# Altium schematic sheet FPGA_CONFIG.SchDoc
size B
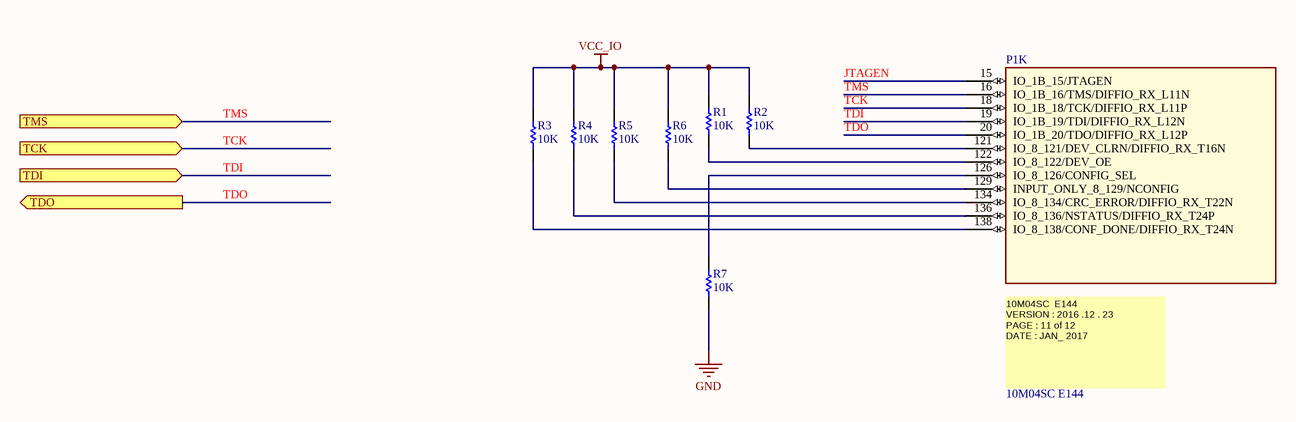
[diagram p0: FPGA_CONFIG.SchDoc]

## Parts
P1  10M04SC E144  (part K of 12)
R1  10K  [AXIAL-0.3]
R2  10K  [AXIAL-0.3]
R3  10K  [AXIAL-0.3]
R4  10K  [AXIAL-0.3]
R5  10K  [AXIAL-0.3]
R6  10K  [AXIAL-0.3]
R7  10K  [AXIAL-0.3]

## Ports
TCK (in), TDI (in), TDO (out), TMS (in)

## Nets
GND: R7.1
VCC_IO: R1.2 R2.2 R3.2 R4.2 R5.2 R6.2
JTAGEN: P1.15(IO_1B_15/JTAGEN)
TCK: P1.18(IO_1B_18/TCK/DIFFIO_RX_L11P) ; port TCK
TDI: P1.19(IO_1B_19/TDI/DIFFIO_RX_L12N) ; port TDI
TDO: P1.20(IO_1B_20/TDO/DIFFIO_RX_L12P) ; port TDO
TMS: P1.16(IO_1B_16/TMS/DIFFIO_RX_L11N) ; port TMS
NetP1_121: P1.121(IO_8_121/DEV_CLRN/DIFFIO_RX_T16N) R2.1
NetP1_122: P1.122(IO_8_122/DEV_OE) R1.1
NetP1_126: P1.126(IO_8_126/CONFIG_SEL) R7.2
NetP1_129: P1.129(INPUT_ONLY_8_129/NCONFIG) R6.1
NetP1_134: P1.134(IO_8_134/CRC_ERROR/DIFFIO_RX_T22N) R5.1
NetP1_136: P1.136(IO_8_136/NSTATUS/DIFFIO_RX_T24P) R4.1
NetP1_138: P1.138(IO_8_138/CONF_DONE/DIFFIO_RX_T24N) R3.1

## Notes on the sheet
- (in symbol 10M04SC E144, part K) 10M04SC  E144 / VERSION : 2016 .12 . 23 / PAGE : 11 of 12 / DATE : JAN_ 2017 /

## Library data of the parts
P1 = 10M04SC E144: SPLIT_INST: TRUE; SWAP_INFO: (S1+S2+S3+S4+S5+S6+S7+S8+S9+S10+S11+S12)
R1-R7 = Res1: Resistor; Published: 8-Jun-2000; LatestRevisionDate: 17-Jul-2002; LatestRevisionNote: Re-released for DXP Platform.; PackageReference: AXIAL-0.3; Publisher: Altium Limited; PackageDescription: Axial Device, Thru-Hole; 2 Leads; 0.3 in Pin Spacing; Value: 10K